# EAGLE design atcpcb (EAGLE 7.6.0)
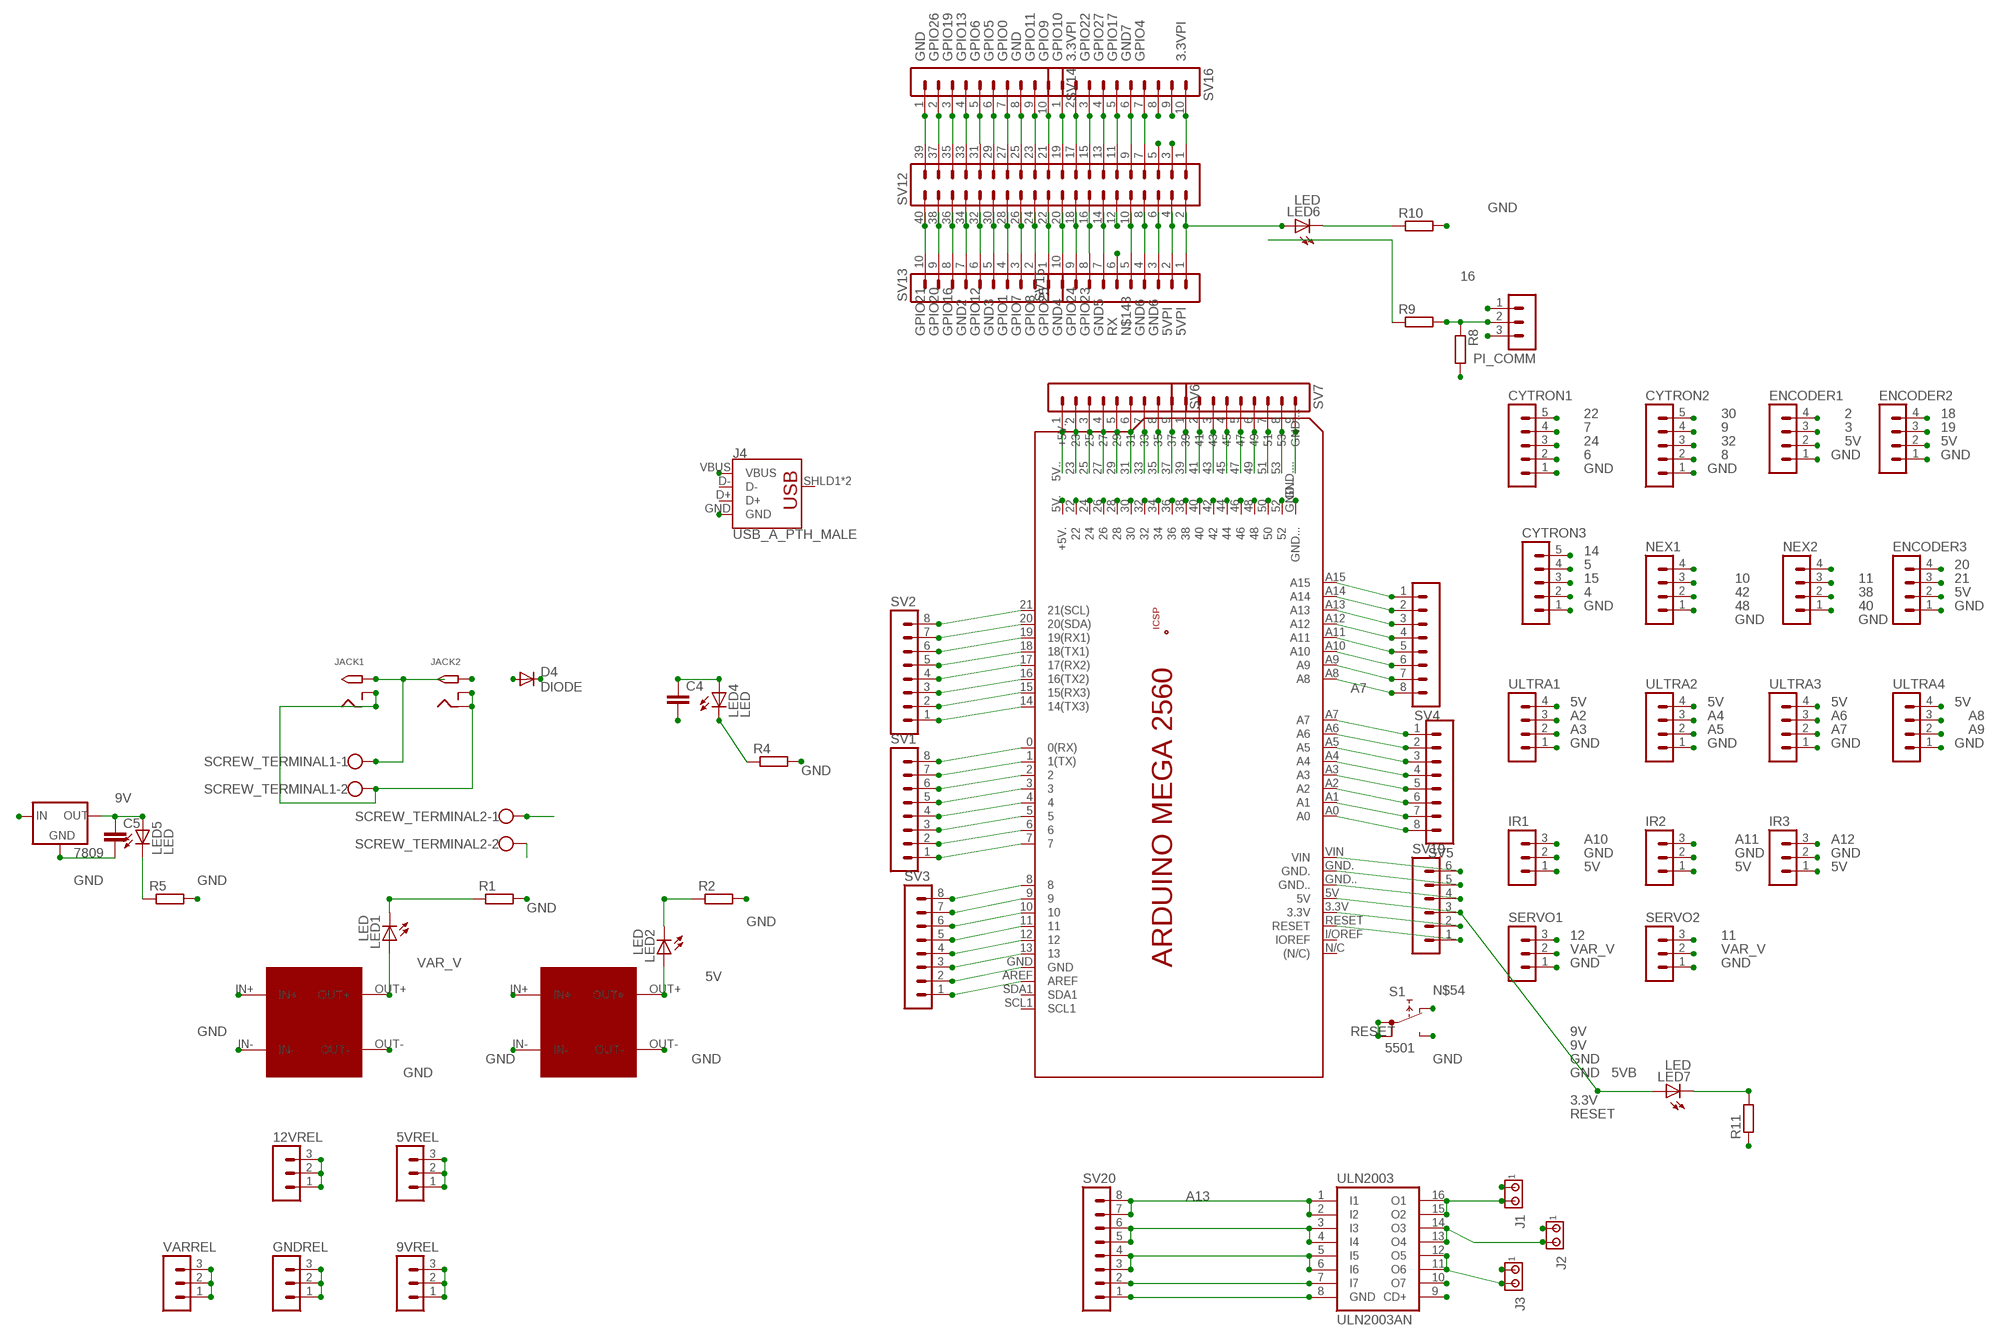
[diagram p0: schematic, sheet 1]

## Parts
5VREL  RELIMATE_03-1  [MA03-1]
9VREL  RELIMATE_03-1  [MA03-1]
12VREL  RELIMATE_03-1  [MA03-1]
7809  VOLTAGE_REGULATOR_78XXS  [78XXS]
C4  CAPACITOR075-063X106  [C075-063X106]
C5  CAPACITOR075-063X106  [C075-063X106]
CYTRON1  RELIMATE_05-1  [MA05-1]
CYTRON2  RELIMATE_05-1  [MA05-1]
CYTRON3  RELIMATE_05-1  [MA05-1]
D4  DIODE  [DIODE]
ENCODER1  RELIMATE_04-1  [MA04-1]
ENCODER2  RELIMATE_04-1  [MA04-1]
ENCODER3  RELIMATE_04-1  [MA04-1]
GNDREL  RELIMATE_03-1  [MA03-1]
IR1  RELIMATE_03-1  [MA03-1]
IR2  RELIMATE_03-1  [MA03-1]
IR3  RELIMATE_03-1  [MA03-1]
J1  MTA02-100  [10X02MTA]
J2  MTA02-100  [10X02MTA]
J3  MTA02-100  [10X02MTA]
J4  USB_A_PTH_MALE  [USB-A-H]
JACK1  2.1MM_POWER_JACKTHM  [POWER_JACK]
JACK2  2.1MM_POWER_JACKTHM  [POWER_JACK]
LED1  LED  [LED3MM]
LED2  LED  [LED3MM]
LED4  LED  [LED3MM]
LED5  LED  [LED3MM]
LED6  LED  [LED3MM]
LED7  LED  [LED3MM]
NEX1  RELIMATE_04-1  [MA04-1]
NEX2  RELIMATE_04-1  [MA04-1]
PCB1  ARDUINO_MEGA2560  [ARDUINO_MEGA2560]
PI_COMM  RELIMATE_03-1  [MA03-1]
R1  RESISTANCE0207/10  [0207/10]
R2  RESISTANCE0207/10  [0207/10]
R4  RESISTANCE0207/10  [0207/10]
R5  RESISTANCE0207/10  [0207/10]
R8  RESISTANCE0207/10  [0207/10]
R9  RESISTANCE0207/10  [0207/10]
R10  RESISTANCE0207/10  [0207/10]
R11  RESISTANCE0207/10  [0207/10]
S1  5501  [5501]
SCREW_TERMINAL1  SCREW_TERMINAL_POWER  [POWER_CONNECTOR]
SCREW_TERMINAL2  SCREW_TERMINAL_POWER  [POWER_CONNECTOR]
SERVO1  RELIMATE_03-1  [MA03-1]
SERVO2  RELIMATE_03-1  [MA03-1]
SV1  RELIMATE_08-1  [MA08-1]
SV2  RELIMATE_08-1  [MA08-1]
SV3  RELIMATE_08-1  [MA08-1]
SV4  RELIMATE_08-1  [MA08-1]
SV5  RELIMATE_08-1  [MA08-1]
SV6  RELIMATE_09-1  [MA09-1]
SV7  RELIMATE_09-1  [MA09-1]
SV12  RELIMATE_20-2  [MA20-2]
SV13  RELIMATE_10-1  [MA10-1]
SV14  RELIMATE_10-1  [MA10-1]
SV15  RELIMATE_10-1  [MA10-1]
SV16  RELIMATE_10-1  [MA10-1]
SV19  RELIMATE_06-1  [MA06-1]
SV20  RELIMATE_08-1  [MA08-1]
U$1  BUCK_CONVERTER  [BUCK_CONVERTER]
U$2  BUCK_CONVERTER  [BUCK_CONVERTER]
ULN2003  ULN2003AN  [DIL16]
ULTRA1  RELIMATE_04-1  [MA04-1]
ULTRA2  RELIMATE_04-1  [MA04-1]
ULTRA3  RELIMATE_04-1  [MA04-1]
ULTRA4  RELIMATE_04-1  [MA04-1]
VARREL  RELIMATE_03-1  [MA03-1]

## Nets
0: PCB1.0(0(RX)) SV1.8
1: PCB1.1(1(TX)) SV1.7
2: ENCODER1.4 PCB1.2 SV1.6
3: ENCODER1.3 PCB1.3 SV1.5
3.3V: PCB1.3.3V SV19.2
3.3VPI: SV12.1 SV12.17 SV16.2 SV16.10
4: CYTRON3.2 PCB1.4 SV1.4
5: CYTRON3.4 PCB1.5 SV1.3
5V: 5VREL.1 5VREL.2 5VREL.3 ENCODER1.2 ENCODER2.2 ENCODER3.2 IR1.1 IR2.1 IR3.1 J4.VBUS LED2.A U$2.OUT+ ULTRA1.4 ULTRA2.4 ULTRA3.4 ULTRA4.4
5VB: LED7.A PCB1.5V SV19.3
5VC: PCB1.5V.(+5V.) PCB1.5V..(+5V..) SV6.1
5VPI: LED6.A SV12.2 SV12.4 SV15.1 SV15.2
6: CYTRON1.2 PCB1.6 SV1.2
7: CYTRON1.4 PCB1.7 SV1.1
8: CYTRON2.2 PCB1.8 SV3.8
9: CYTRON2.4 PCB1.9 SV3.7
9V: 9VREL.1 9VREL.2 9VREL.3 7809.OUT C5.1 LED5.A PCB1.VIN SV19.6
10: NEX1.4 PCB1.10 SV3.6
11: NEX2.4 PCB1.11 SERVO2.3 SV3.5
12: PCB1.12 SERVO1.3 SV3.4
12V: 12VREL.1 12VREL.2 12VREL.3 7809.IN C4.1 D4.C J1.1 J2.1 J3.1 LED4.A U$1.IN+ U$2.IN+ ULN2003.9(CD+)
13: PCB1.13 SV3.3
14: CYTRON3.5 PCB1.14(14(TX3)) SV2.1
15: CYTRON3.3 PCB1.15(15(RX3)) SV2.2
16: PCB1.16(16(TX2)) PI_COMM.1 SV2.3
17: PCB1.17(17(RX2)) PI_COMM.2 R8.1 R9.2 SV2.4
18: ENCODER2.4 PCB1.18(18(TX1)) SV2.5
19: ENCODER2.3 PCB1.19(19(RX1)) SV2.6
20: ENCODER3.4 PCB1.20(20(SDA)) SV2.7
21: ENCODER3.3 PCB1.21(21(SCL)) SV2.8
22: CYTRON1.5 PCB1.22
23: PCB1.23 SV6.2
24: CYTRON1.3 PCB1.24
25: PCB1.25 SV6.3
26: PCB1.26
27: PCB1.27 SV6.4
28: PCB1.28
29: PCB1.29 SV6.5
30: CYTRON2.5 PCB1.30
31: PCB1.31 SV6.6
32: CYTRON2.3 PCB1.32
33: PCB1.33 SV6.7
34: PCB1.34
35: PCB1.35 SV6.8
36: PCB1.36
37: PCB1.37 SV6.9
38: NEX2.3 PCB1.38
39: PCB1.39 SV7.1
40: NEX2.2 PCB1.40
41: PCB1.41 SV7.2
42: NEX1.3 PCB1.42
43: PCB1.43 SV7.3
44: PCB1.44
45: PCB1.45 SV7.4
46: PCB1.46
47: PCB1.47 SV7.5
48: NEX1.2 PCB1.48
49: PCB1.49 SV7.6
50: PCB1.50
51: PCB1.51 SV7.7
52: PCB1.52
53: PCB1.53 SV7.8
A0: PCB1.A0 SV5.8
A1: PCB1.A1 SV5.7
A2: PCB1.A2 SV5.6 ULTRA1.3
A3: PCB1.A3 SV5.5 ULTRA1.2
A4: PCB1.A4 SV5.4 ULTRA2.3
A5: PCB1.A5 SV5.3 ULTRA2.2
A6: PCB1.A6 SV5.2 ULTRA3.3
A7: PCB1.A7 SV5.1 ULTRA3.2
A8: PCB1.A8 SV4.8 ULTRA4.3
A9: PCB1.A9 SV4.7 ULTRA4.2
A10: IR1.3 PCB1.A10 SV4.6
A11: IR2.3 PCB1.A11 SV4.5
A12: IR3.3 PCB1.A12 SV4.4
A13: PCB1.A13 SV4.3 SV20.7 SV20.8 ULN2003.1(I1) ULN2003.2(I2)
A14: PCB1.A14 SV4.2 SV20.5 SV20.6 ULN2003.3(I3) ULN2003.4(I4)
A15: PCB1.A15 SV4.1 SV20.3 SV20.4 ULN2003.5(I5) ULN2003.6(I6)
AREF: PCB1.AREF SV3.1
GND: 7809.GND C4.2 C5.2 CYTRON1.1 CYTRON2.1 CYTRON3.1 ENCODER1.1 ENCODER2.1 ENCODER3.1 GNDREL.1 GNDREL.2 GNDREL.3 IR1.2 IR2.2 IR3.2 J4.GND JACK1.RING JACK1.RING_SW JACK2.RING JACK2.RING_SW NEX1.1 NEX2.1 PCB1.GND PCB1.GND. PCB1.GND.. PCB1.GND... PCB1.GND.... PI_COMM.3 R1.2 R2.2 R4.2 R5.2 R8.2 R10.2 R11.1 S1.NO SCREW_TERMINAL1.2 SCREW_TERMINAL2.2 SERVO1.1 SERVO2.1 SV3.2 SV7.9 SV12.25 SV12.39 SV14.1 SV14.8 SV19.4 SV19.5 SV20.1 U$1.IN- U$1.OUT- U$2.IN- U$2.OUT- ULN2003.8(GND) ULTRA1.1 ULTRA2.1 ULTRA3.1 ULTRA4.1
GND2: SV12.34 SV13.7
GND3: SV12.30 SV13.5
GND4: SV12.20 SV15.10
GND5: SV12.14 SV15.7
GND6: SV12.6 SV12.8 SV15.3 SV15.4
GND7: SV12.9 SV16.6
GPIO0: SV12.27 SV14.7
GPIO1: SV12.28 SV13.4
GPIO4: SV12.7 SV16.7
GPIO5: SV12.29 SV14.6
GPIO6: SV12.31 SV14.5
GPIO7: SV12.26 SV13.3
GPIO8: SV12.24 SV13.2
GPIO9: SV12.21 SV14.10
GPIO10: SV12.19 SV16.1
GPIO11: SV12.23 SV14.9
GPIO12: SV12.32 SV13.6
GPIO13: SV12.33 SV14.4
GPIO16: SV12.36 SV13.8
GPIO17: SV12.11 SV16.5
GPIO19: SV12.35 SV14.3
GPIO20: SV12.38 SV13.9
GPIO21: SV12.40 SV13.10
GPIO22: SV12.15 SV16.3
GPIO23: SV12.16 SV15.8
GPIO24: SV12.18 SV15.9
GPIO25: SV12.22 SV13.1
GPIO26: SV12.37 SV14.2
GPIO27: SV12.13 SV16.4
N$17: LED1.K(C) R1.1
N$21: LED2.K(C) R2.1
N$33: LED6.K(C) R10.1
N$49: LED7.K(C) R11.2
N$52: SV20.2 ULN2003.7(I7)
N$54: S1.NC
N$65: J1.2 ULN2003.15(O2) ULN2003.16(O1)
N$67: J2.2 ULN2003.13(O4) ULN2003.14(O3)
N$69: J3.2 ULN2003.11(O6) ULN2003.12(O5)
N$71: ULN2003.10(O7)
N$77: LED4.K(C) R4.1
N$85: LED5.K(C) R5.1
N$143: SV12.10 SV15.5
RESET: PCB1.RESET S1.1A S1.1B SV19.1
RX: R9.1 SV12.12 SV15.6
SCL: SV12.5 SV16.8
SDA: SV12.3 SV16.9
VAR_V: LED1.A SERVO1.2 SERVO2.2 U$1.OUT+ VARREL.1 VARREL.2 VARREL.3
VIN: D4.A JACK1.TIP JACK2.TIP SCREW_TERMINAL1.1 SCREW_TERMINAL2.1
Unconnected: J4.D+ J4.D- J4.SHLD1(SHIELD) J4.SHLD2(SHIELD) PCB1.+5V_ PCB1.GND__ PCB1.I/OREF(IOREF) PCB1.MISO PCB1.MOSI PCB1.N/C((N/C)) PCB1.RESET. PCB1.SCK PCB1.SCL1 PCB1.SDA1

## Library data of the parts
5VREL 9VREL 12VREL GNDREL IR1-IR3 PI_COMM SERVO1 SERVO2 VARREL = robocon:RELIMATE_03-1: PIN HEADER; OC_FARNELL: unknown; OC_NEWARK: unknown
7809 = robocon:VOLTAGE_REGULATOR_78XXS: VOLTAGE REGULATOR
C4 C5 = robocon:CAPACITOR: CAPACITOR, European symbol
CYTRON1-CYTRON3 = robocon:RELIMATE_05-1: PIN HEADER; OC_FARNELL: unknown; OC_NEWARK: unknown
D4 = robocon:DIODE: DIODE fast recovery diode, 5 A, 800 V
ENCODER1-ENCODER3 NEX1 NEX2 ULTRA1-ULTRA4 = robocon:RELIMATE_04-1: PIN HEADER; OC_FARNELL: unknown; OC_NEWARK: unknown
J1-J3 = con-amp:MTA02-100: AMP connector
J4 = SparkFun-Connectors:USB_A: USB-A Connector Male and female variants, as well as PTH and SMT variants SparkFun Products: SparkFun XBee Explorer Dongle <https://www.sparkfun.com/products/11697> PTH Male SparkFun MicroView-USB Programmer <https://www.sparkfun.com/products/12924> SMT Male SparkFun USB Type A Female Breakout <https://www.sparkfun.com/products/12700> SMT Female; PROD_ID: CONN-08367; SF_ID: PRT-00437
JACK1 JACK2 = robocon:2.1MM_POWER_JACK: 2.1mm x 5.5mm THM DC jack with internal switch. Digikey part #PJ-102A, 4UCON part #05537 2.1mm x 5.5mm SMT DC jack with internal switch. Digikey part #PJ-002A-SMT, 4UCON part #03267 By microbuilder.eu & adafruit.com
LED1 LED2 LED4-LED7 = robocon:LED: Low Current (2mA) LED 3 mm Tinted Diffused Package color RED Source: Data sheet <http://www.farnell.com/datasheets/391100.pdf>; MF: VISHAY SEMICONDUCTOR; OC_FARNELL: 1612437
PCB1 = robocon:ARDUINO_MEGA2560: Device for representing an Arduino Mega 2560 board with a footprint in an EAGLE design. Created by Dave Young for Element14. More EAGLE documentation at: http://www.element14.com/community/community/knode/cadsoft_eagle
R1 R2 R4 R5 R8-R11 = robocon:RESISTANCE: RESISTOR, European symbol
S1 = switch:55?: PUSHBUTTON SERIES 5500 SWITCHES Source: www.e-switch.com .. 5500.pdf
SCREW_TERMINAL1 SCREW_TERMINAL2 = robocon:SCREW_TERMINAL_POWER: WAGO SCREW CLAMP; MPN: 237-102; OC_FARNELL: unknown; OC_NEWARK: 70K9898
SV1-SV5 SV20 = robocon:RELIMATE_08-1: PIN HEADER; OC_FARNELL: unknown; OC_NEWARK: unknown
SV6 SV7 = robocon:RELIMATE_09-1: PIN HEADER; OC_FARNELL: unknown; OC_NEWARK: unknown
SV12 = robocon:RELIMATE_20-2: PIN HEADER; OC_FARNELL: unknown; OC_NEWARK: unknown
SV13-SV16 = robocon:RELIMATE_10-1: PIN HEADER; OC_FARNELL: unknown; OC_NEWARK: unknown
SV19 = robocon:RELIMATE_06-1: PIN HEADER; OC_FARNELL: unknown; OC_NEWARK: unknown
U$1 U$2 = robocon:BUCK_CONVERTER: LM2596-DC-DC-buck-converter-adjustable-3V-40V-step-down-module-power-supply LM; MF: POWER INTEGRATIONS; MPN: LNK304DN; OC_FARNELL: 1448222
ULN2003 = uln-udn:ULN2003A: DRIVER ARRAY

## Net classes
0 default: width 0.381 mm, drill 0.381 mm, clearance 0.254 mm

## Board
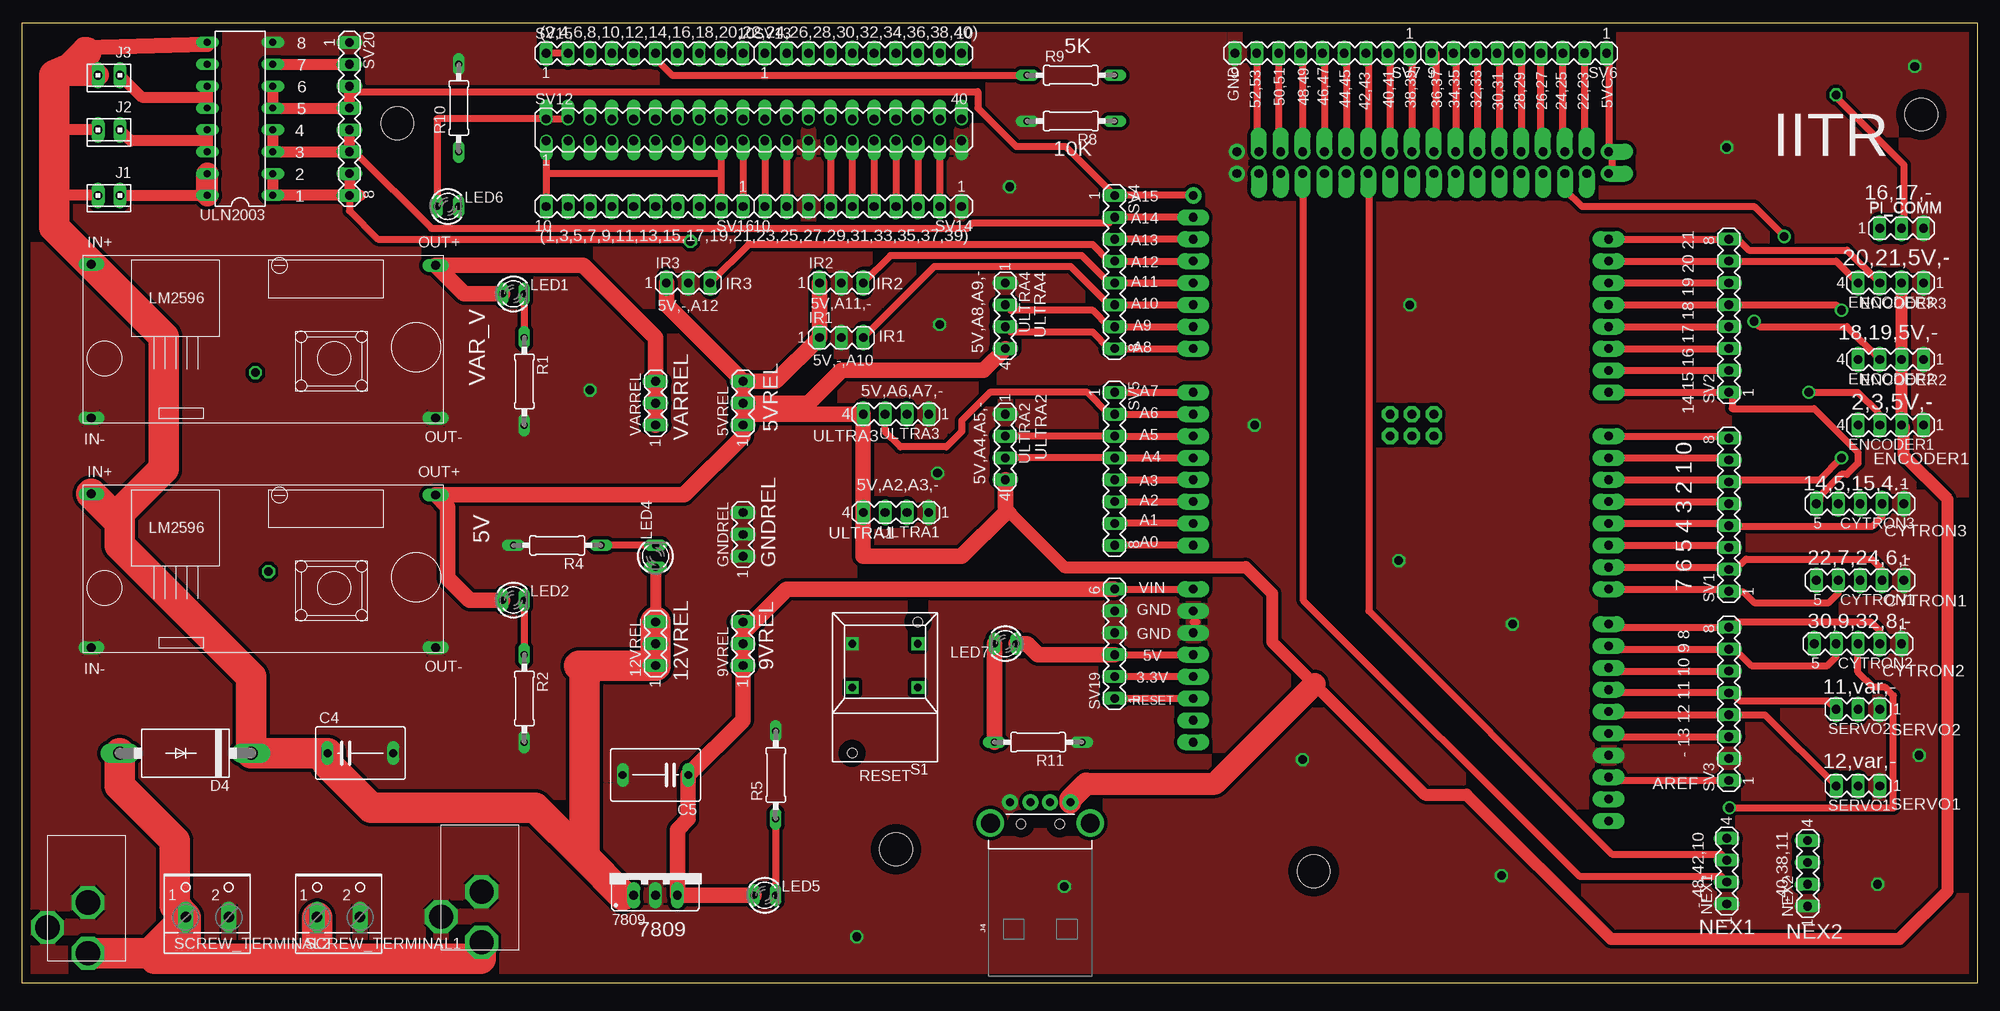
[diagram p1: board, top side]
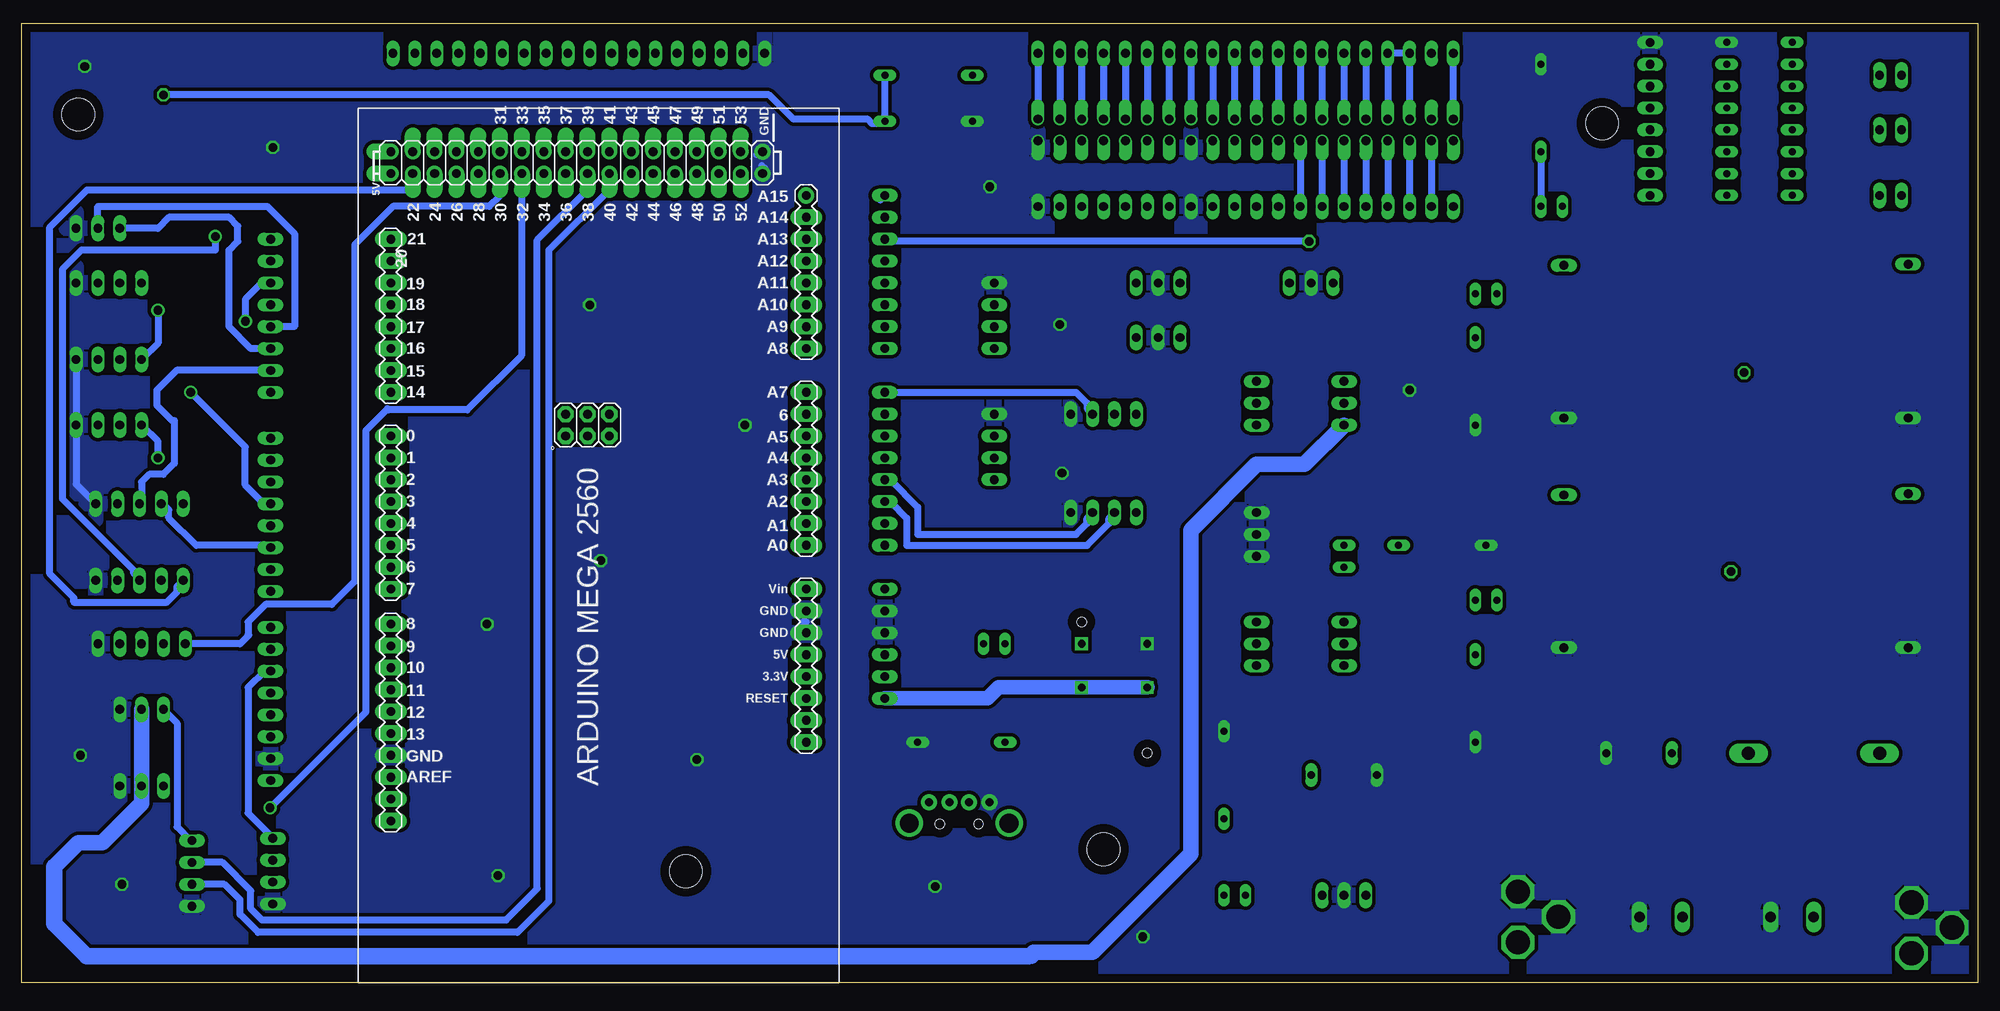
[diagram p2: board, bottom side, seen from below]

Size 227.31 x 111.43 mm. Coordinates in mm from the lower left corner, seen from the top.
Outline: 0,0 227.31,0 227.31,111.43 0,111.43 0,0
Copper layers (1*16): Top 0.035mm / dielectric 1.5mm / Bottom 0.035mm
Design rules "default *": minimum track width 32mil, minimum drill 40mil, track to track 16mil, track to pad 16mil, pad to pad 16mil, via to via 16mil, smd to smd 6mil, copper to edge 40mil, drill to drill 16mil, minimum pad ring 10mil, minimum via ring 8mil, stop-mask expansion 4mil, vias tented up to drill 0mil, thermal gap 10mil
Holes 3.81 mm at 101.6,15.49 150.11,12.95 220.73,100.84 43.69,99.82

### Footprints (pad centres in the part's own frame; a part is rotated, then mirrored left to right if it is on the bottom)
MA03-1 = drill 1.016 long: 1 -2.54,0; 2 0,0; 3 2.54,0
78XXS = drill 1.016 long: GND 0,-2.54; IN -2.54,-2.54; OUT 2.54,-2.54
C075-063X106 = drill 0.914 long: 1 -3.81,0; 2 3.81,0
MA05-1 = drill 1.016 long: 1 -5.08,0; 2 -2.54,0; 3 0,0; 4 2.54,0; 5 5.08,0
DIODE = drill 1.499 long: A 7.62,0; C -7.62,0
MA04-1 = drill 1.016 long: 1 -3.81,0; 2 -1.27,0; 3 1.27,0; 4 3.81,0
10X02MTA = drill 1.016 long: 1 1.27,0; 2 -1.27,0
USB-A-H = drill 0.914 pad 1.88: D+ 2.4,1.127; D- 2.4,-1.127; GND 2.4,3.5; VBUS 2.4,-3.5 | drill 2.2: SHLD1 0,-5.8; SHLD2 0,5.8 | hole 1.1: -0.1,2.25; -0.1,-2.25
POWER_JACK = drill 2.8 pad 3.81 octagon: RING 0.1,-3.39; RING_SW -4.6,-6.29; TIP 0.1,-9.29
LED3MM = drill 0.813 long: A -1.27,0; K 1.27,0
ARDUINO_MEGA2560 = drill 1.016 pad 1.88 long: 0 63.5,50.8; 1 60.96,50.8; 2 58.42,50.8; 3 55.88,50.8; 3.3V 35.56,2.54; 4 53.34,50.8; 5 50.8,50.8; 5V 38.1,2.54; 6 48.26,50.8; 7 45.72,50.8; 8 41.656,50.8; 9 39.116,50.8; 10 36.576,50.8; 11 34.036,50.8; 12 31.496,50.8; 13 28.956,50.8; 14 68.58,50.8; 15 71.12,50.8; 16 73.66,50.8; 17 76.2,50.8; 18 78.74,50.8; 19 81.28,50.8; 20 83.82,50.8; 21 86.36,50.8; A0 50.8,2.54; A1 53.34,2.54; A2 55.88,2.54; A3 58.42,2.54; A4 60.96,2.54; A5 63.5,2.54; A6 66.04,2.54; A7 68.58,2.54; A8 73.66,2.54; A9 76.2,2.54; A10 78.74,2.54; A11 81.28,2.54; A12 83.82,2.54; A13 86.36,2.54; A14 88.9,2.54; AREF 23.876,50.8; GND 26.416,50.8; GND. 43.18,2.54; GND.. 40.64,2.54; I/OREF 30.48,2.54; N/C 27.94,2.54; RESET 33.02,2.54; SCL1 18.796,50.8; SDA1 21.336,50.8; VIN 45.72,2.54 | drill 1.016 pad 1.88 offset: 5V. 93.98,50.8; 5V.. 96.52,50.8; 22 93.98,48.26; 23 96.52,48.26; 24 93.98,45.72; 25 96.52,45.72; 26 93.98,43.18; 27 96.52,43.18; 28 93.98,40.64; 29 96.52,40.64; 30 93.98,38.1; 31 96.52,38.1; 32 93.98,35.56; 33 96.52,35.56; 34 93.98,33.02; 35 96.52,33.02; 36 93.98,30.48; 37 96.52,30.48; 38 93.98,27.94; 39 96.52,27.94; 40 93.98,25.4; 41 96.52,25.4; 42 93.98,22.86; 43 96.52,22.86; 44 93.98,20.32; 45 96.52,20.32; 46 93.98,17.78; 47 96.52,17.78; 48 93.98,15.24; 49 96.52,15.24; 50 93.98,12.7; 51 96.52,12.7; 52 93.98,10.16; 53 96.52,10.16 | drill 1.016 pad 1.88 octagon: +5V_ 66.04,30.48; GND__ 66.04,25.4; MISO 63.5,30.48; MOSI 66.04,27.94; RESET. 63.5,25.4; SCK 63.5,27.94 | drill 1.016 pad 1.88: A15 91.44,2.54; GND... 93.98,7.62; GND.... 96.52,7.62
0207/10 = drill 0.813 long: 1 -5.08,0; 2 5.08,0
5501 = drill 0.9 pad 1.5 square: 1A 0,3.81; 1B 0,-3.81; NC 5.08,-3.81; NO 5.08,3.81 | hole 1.1: -7.62,3.81; 7.62,-3.81
POWER_CONNECTOR = drill 1.194 long: 1 -2.5,-1.27; 2 2.5,-1.27
MA08-1 = drill 1.016 long: 1 -8.89,0; 2 -6.35,0; 3 -3.81,0; 4 -1.27,0; 5 1.27,0; 6 3.81,0; 7 6.35,0; 8 8.89,0
MA09-1 = drill 1.016 long: 1 -10.16,0; 2 -7.62,0; 3 -5.08,0; 4 -2.54,0; 5 0,0; 6 2.54,0; 7 5.08,0; 8 7.62,0; 9 10.16,0
MA20-2 = drill 1.016 offset: 1 -24.13,-1.27; 2 -24.13,1.27; 3 -21.59,-1.27; 4 -21.59,1.27; 5 -19.05,-1.27; 6 -19.05,1.27; 7 -16.51,-1.27; 8 -16.51,1.27; 9 -13.97,-1.27; 10 -13.97,1.27; 11 -11.43,-1.27; 12 -11.43,1.27; 13 -8.89,-1.27; 14 -8.89,1.27; 15 -6.35,-1.27; 16 -6.35,1.27; 17 -3.81,-1.27; 18 -3.81,1.27; 19 -1.27,-1.27; 20 -1.27,1.27; 21 1.27,-1.27; 22 1.27,1.27; 23 3.81,-1.27; 24 3.81,1.27; 25 6.35,-1.27; 26 6.35,1.27; 27 8.89,-1.27; 28 8.89,1.27; 29 11.43,-1.27; 30 11.43,1.27; 31 13.97,-1.27; 32 13.97,1.27; 33 16.51,-1.27; 34 16.51,1.27; 35 19.05,-1.27; 36 19.05,1.27; 37 21.59,-1.27; 38 21.59,1.27; 39 24.13,-1.27; 40 24.13,1.27
MA10-1 = drill 1.016 long: 1 -11.43,0; 2 -8.89,0; 3 -6.35,0; 4 -3.81,0; 5 -1.27,0; 6 1.27,0; 7 3.81,0; 8 6.35,0; 9 8.89,0; 10 11.43,0
MA06-1 = drill 1.016 long: 1 -6.35,0; 2 -3.81,0; 3 -1.27,0; 4 1.27,0; 5 3.81,0; 6 6.35,0
BUCK_CONVERTER = drill 1.016 long: IN+ -18.558,7.255; IN- -18.558,-10.618; OUT+ 21.442,7.128; OUT- 21.442,-10.618
DIL16 = drill 0.813 long: 1 -8.89,-3.81; 2 -6.35,-3.81; 3 -3.81,-3.81; 4 -1.27,-3.81; 5 1.27,-3.81; 6 3.81,-3.81; 7 6.35,-3.81; 8 8.89,-3.81; 9 8.89,3.81; 10 6.35,3.81; 11 3.81,3.81; 12 1.27,3.81; 13 -1.27,3.81; 14 -3.81,3.81; 15 -6.35,3.81; 16 -8.89,3.81

### Placement (x,y rotation side)
5VREL  83.82,67.31 90 top
9VREL  83.82,39.37 90 top
12VREL  73.66,39.37 90 top
7809  73.66,12.7 0 top
C4  39.37,26.67 0 top
C5  73.66,24.13 180 top
CYTRON1  213.61,46.74 180 top
CYTRON2  213.36,39.37 180 top
CYTRON3  213.61,55.63 180 top
D4  19.05,26.67 180 top
ENCODER1  217.17,64.77 180 top
ENCODER2  217.17,72.39 180 top
ENCODER3  217.17,81.28 180 top
GNDREL  83.82,52.07 90 top
IR1  95.25,74.93 0 top
IR2  95.25,81.28 0 top
IR3  77.47,81.28 0 top
J1  10.16,91.44 180 top
J2  10.16,99.06 180 top
J3  10.16,105.41 180 top
J4  118.36,18.54 90 top
JACK1  7.62,12.7 0 top
JACK2  53.34,13.97 0 top
LED1  57.15,80.01 0 top
LED2  57.15,44.45 0 top
LED4  73.66,49.53 90 top
LED5  86.36,10.16 0 top
LED6  49.53,90.17 0 top
LED7  114.3,39.37 180 top
NEX1  198.12,12.95 90 top
NEX2  207.52,12.7 90 top
PCB1  133.6,0 90 bottom
PI_COMM  218.44,87.63 0 top
R1  58.42,69.85 270 top
R2  58.42,33.02 270 top
R4  62.23,50.8 180 top
R5  87.63,24.13 90 top
R8  121.92,100.08 180 top
R9  121.92,105.41 0 top
R10  50.8,101.6 90 top
R11  118.11,27.94 180 top
S1  100.33,34.29 90 top
SCREW_TERMINAL1  36.83,8.89 0 top
SCREW_TERMINAL2  21.59,8.89 0 top
SERVO1  213.36,22.86 180 top
SERVO2  213.36,31.75 180 top
SV1  198.37,54.36 90 top
SV2  198.37,77.47 90 top
SV3  198.37,32.38 90 top
SV4  127,82.55 270 top
SV5  127,59.69 270 top
SV6  173.99,107.95 180 top
SV7  151.13,107.95 180 top
SV12  85.09,99.06 0 top
SV13  97.79,107.95 0 top
SV14  97.79,90.17 180 top
SV15  72.39,107.95 0 top
SV16  72.39,90.17 180 top
SV19  127,39.37 90 top
SV20  38.1,100.33 270 top
U$1  26.67,76.2 0 top
U$2  26.67,49.53 0 top
ULN2003  25.4,100.33 90 top
ULTRA1  101.6,54.61 180 top
ULTRA2  114.3,62.23 270 top
ULTRA3  101.6,66.04 180 top
ULTRA4  114.3,77.47 270 top
VARREL  73.66,67.31 90 top

### Tracks (layer width: path | path; a pad name or v marks a point on that pad's centre or on a via)
0
  Top 0.813: PCB1.0 198.12,63.5 SV1.8
1
  Top 0.813: PCB1.1 198.12,60.96 SV1.7
2  (via drill 1.02)
  Top 0.813: PCB1.2 198.12,58.42 SV1.6 198.75,58.42 208.92,58.42 v211.46,60.96
  Bottom 0.813: ENCODER1.4 211.46,62.87 v211.46,60.96
3  (via drill 1.02)
  Top 0.813: PCB1.3 198.12,55.88 SV1.5 | v207.65,68.58 213.36,68.58 215.65,66.29 215.65,65.02 ENCODER1.3
  Bottom 0.813: v207.65,68.58 201.3,62.23 201.3,57.79 198.75,55.25 SV1.5
3.3V
  Top 0.813: PCB1.3.3V SV19.2
3.3VPI
  Top 0.813: SV12.1 60.96,93.98 | 60.96,93.98 SV16.10 | SV12.17 81.28,93.98 | 81.28,93.98 SV16.2 | 81.28,93.98 60.96,93.98
4
  Top 0.813: PCB1.4 198.12,53.34 SV1.4 198.75,53.02 215.08,53.02 216.15,54.1 CYTRON3.2 215.9,55.56
5
  Top 0.813: PCB1.5 198.12,50.8 SV1.3
  Bottom 0.813: CYTRON3.4 210.82,55.56 210.19,54.93 210.19,53.98 207.01,50.8 198.44,50.8 SV1.3
5V
  Top 0.813: 90.81,66.04 90.81,67.31 | 114.94,54.61 114.3,54.61
  Top 1.422: 114.94,54.61 114.94,54.48 121.16,48.26 142.24,48.26 145.29,45.21 145.29,39.62 150.24,34.67 163.07,21.84 167.89,21.84 184.66,5.08 218.19,5.08 223.77,10.67 223.77,56.13 218.69,61.21 218.69,64.52 ENCODER1.2 ENCODER2.2 ENCODER3.2
  Top 1.778: LED2.A 52.07,44.45 49.53,46.99 49.53,55.24 U$2.OUT+ 76.98,56.66 83.82,63.5 5VREL.1 83.82,66.04 | 5VREL.3 83.82,66.04 | IR3.1 74.93,78.74 5VREL.3 | IR2.1 IR1.1 87.63,69.85 5VREL.3 | 83.82,66.04 90.81,66.04 ULTRA3.4 ULTRA1.4 97.79,49.53 109.22,49.53 114.3,54.61 ULTRA2.4 | 5VREL.2 90.81,67.31 91.44,67.31 95.25,71.12 111.76,71.12 ULTRA4.4
  Top 2.54: J4.VBUS 121.86,21.28 123.7,23.11 138.68,23.11 150.24,34.67
5VB
  Top 0.813: SV19.3 PCB1.5V
  Top 1.778: SV19.3 118.11,38.1 116.84,39.37 LED7.A
5VC
  Top 0.813: PCB1.5V. 184.79,93.98 184.79,96.52 PCB1.5V.. 184.4,107.95 SV6.1
  Bottom 0.813: 184.15,96.52 PCB1.5V..
5VPI
  Top 0.813: SV15.2 SV15.1 | LED6.A 48.26,100.33 SV12.2 SV12.4
  Bottom 0.813: SV12.2 SV15.1
6
  Top 0.813: PCB1.6 198.12,48.26 SV1.2 198.75,47.94 199.07,47.94 200.34,49.21 214.95,49.21 216.15,48.01 CYTRON1.2 215.9,46.99
7
  Top 0.813: PCB1.7 198.12,45.72 SV1.1 198.75,45.4 200.03,45.4 201.3,44.13 209.99,44.13 211.07,45.21 CYTRON1.4 210.82,46.67
8
  Top 0.813: PCB1.8 184.79,41.28 SV3.8 198.75,41.28 199.39,41.91 214.88,41.91 215.9,40.89 CYTRON2.2
9
  Top 0.813: PCB1.9 184.79,38.74 SV3.7 199.07,38.74 200.98,36.83 209.8,36.83 210.82,37.85 CYTRON2.4
9V
  Top 0.813: SV19.6 PCB1.VIN
  Top 1.778: LED5.A 7809.OUT 76.2,17.78 77.47,19.05 C5.1 83.82,30.48 9VREL.1 9VREL.2 83.82,40.64 | 83.82,40.64 9VREL.3 | SV19.6 88.9,45.72 83.82,40.64
10
  Top 0.813: SV3.6 184.79,36.2 PCB1.10
  Bottom 0.813: SV3.6 199.07,36.2 200.98,34.29 200.98,19.68 198.12,16.83 NEX1.4
11
  Top 0.813: PCB1.11 184.79,33.66 SV3.5 198.75,33.66 199.71,32.7 209.87,32.7 SERVO2.3
  Bottom 0.813: SERVO2.3 209.23,30.16 209.23,18.1 207.65,16.51 NEX2.4
12
  Top 0.813: PCB1.12 184.79,31.11 SV3.4 202.56,31.11 SERVO1.3
12V
  Top 0.813: ULN2003.9 21.59,109.02 | 7809.IN 69.85,10.16
  Top 1.27: LED4.A 73.66,40.64 | J2.1 5.08,99.06 3.81,97.79 | J1.1 3.81,91.44
  Top 1.778: 7.25,108.59 21.59,109.02
  Top 2.54: 7.51,108.09 7.25,108.59 | J3.1 5.08,105.41 5.59,106.17
  Top 3.556: 65.41,14.61 59.69,20.32 40.64,20.32 35.56,25.4 C4.1 D4.C 26.67,35.56 11.43,50.8 11.43,53.47 | 65.41,14.61 69.85,10.16 | 65.41,14.61 65.41,36.2 64.77,36.83 12VREL.1 12VREL.2 73.66,40.64 12VREL.3 | 11.43,53.47 U$2.IN+ | 11.43,53.47 11.43,54.61 16.51,59.69 16.51,75.06 U$1.IN+ 3.81,87.76 3.81,91.44 3.81,97.79 3.81,105.41 5.59,106.17 7.51,108.09
13
  Top 0.813: SV3.3 184.79,28.57 PCB1.13
14
  Top 0.813: PCB1.14 SV2.1 198.75,68.58 198.75,66.67 208.28,66.67 213.36,61.6 213.36,60.33 212.09,59.05 211.46,59.05 208.92,56.52 208.92,55.88 CYTRON3.5
15
  Top 0.813: PCB1.15 SV2.2
  Bottom 0.813: SV2.2 209.3,71.12 211.58,68.83 211.58,67.06 209.8,65.28 209.55,65.28 209.55,60.33 210.82,59.05 212.47,59.05 213.36,58.17 213.36,55.88 CYTRON3.3
16
  Top 0.813: PCB1.16 SV2.3
  Bottom 0.813: PI_COMM.1 211.46,87.63 210.19,88.9 203.2,88.9 202.18,87.88 202.18,86.11 203.2,85.09 203.2,76.2 200.66,73.66 SV2.3
17  (via drill 1)
  Top 0.813: PCB1.17 SV2.4 | v210.82,103.12 210.82,102.87 218.69,95 218.69,87.88 PI_COMM.2
  Bottom 0.813: SV2.4 195.58,76.2 195.58,86.99 198.75,90.17 218.44,90.17 PI_COMM.2 | v210.82,103.12 140.46,103.12 137.67,100.33 129.03,100.33 128.52,99.82 127.25,99.82 R8.1 R9.2
18  (via drill 1.02)
  Top 0.813: PCB1.18 SV2.5 210.82,78.74 v211.46,78.1
  Bottom 0.813: ENCODER2.4 211.46,74.3 v211.46,78.1
19  (via drill 1.02)
  Top 0.813: PCB1.19 SV2.6 | v201.3,76.83 201.93,76.2 212.09,76.2 ENCODER2.3
  Bottom 0.813: v201.3,76.83 201.3,79.38 199.39,81.28 SV2.6
20
  Top 0.813: PCB1.20 SV2.7 210.82,83.82 ENCODER3.4
21
  Top 0.813: PCB1.21 SV2.8 199.39,86.36 200.66,85.09 212.09,85.09 ENCODER3.3
22
  Bottom 0.813: CYTRON1.5 209.23,46.04 209.23,45.4 210.5,44.13 221.17,44.13 221.23,44.2 221.23,44.7 224.03,47.5 224.03,87.76 223.84,87.95 223.58,88.2 219.71,92.08 181.93,92.08 181.93,93.98 PCB1.22
23
  Top 0.813: PCB1.23 181.61,96.52 SV6.2
24  (via drill 1.02)
  Top 0.813: v204.79,86.68 201.3,90.17 181.29,90.17 179.39,92.08 179.39,93.98 PCB1.24
  Bottom 0.813: v204.79,86.68 204.79,85.09 220.35,85.09 222.57,82.87 222.57,56.2 214.31,47.94 214.31,47.62 213.68,46.99 CYTRON1.3
25
  Top 0.813: PCB1.25 179.07,96.52 SV6.3
27
  Top 0.813: PCB1.27 176.53,96.52 SV6.4
29
  Top 0.813: SV6.5 174.24,107.95 PCB1.29
30
  Bottom 0.813: PCB1.30 171.77,93.98 171.77,91.38 172.97,90.17 184.15,90.17 184.28,90.04 188.6,85.72 188.6,46.61 191.26,43.94 198.95,43.94 200.98,41.91 200.98,40.45 200.91,40.39 201.93,39.37 CYTRON2.5
31
  Top 0.813: SV6.6 171.7,107.95 PCB1.31
32  (via drill 1.02)
  Top 0.813: v198.44,20.32 217.49,20.32 217.49,33.34 216.54,34.29 215.14,34.29 213.36,36.07 CYTRON2.3
  Bottom 0.813: v198.44,20.32 187.33,31.43 187.33,64.14 184.79,66.67 184.66,66.55 175.51,66.55 169.23,72.83 169.23,93.98 PCB1.32
33
  Top 0.813: SV6.7 169.16,107.95 PCB1.33
35
  Top 0.813: SV6.8 166.62,107.95 PCB1.35
37
  Top 0.813: SV6.9 164.34,107.95 164.34,96.01 164.08,96.01 PCB1.37
38
  Bottom 0.813: PCB1.38 161.61,93.98 161.61,92.08 167.39,86.3 167.39,10.92 171.01,7.3 199.39,7.3 200.66,8.57 200.66,10.67 203.96,13.97 NEX2.3
39
  Top 0.813: SV7.1 161.54,107.95 PCB1.39
40
  Bottom 0.813: PCB1.40 159.07,93.98 159.07,92.08 166.05,85.09 166.05,9.46 169.67,5.84 199.84,5.84 201.93,7.94 201.93,9.65 203.71,11.43 NEX2.2
41
  Top 0.813: SV7.2 159,107.95 PCB1.41
42
  Top 0.813: NEX1.3 198.12,14.29 197.49,14.92 184.79,14.92 156.53,43.18 156.53,93.98 PCB1.42
43
  Top 0.813: SV7.3 156.46,107.95 PCB1.43
45
  Top 0.813: SV7.4 153.92,107.95 PCB1.45
47
  Top 0.813: SV7.5 151.38,107.95 PCB1.47
48
  Top 0.813: NEX1.2 198.12,11.75 197.49,12.38 180.98,12.38 148.91,44.45 148.91,93.98 PCB1.48
49
  Top 0.813: SV7.6 148.84,107.95 PCB1.49
51
  Top 0.813: SV7.7 146.05,96.77 PCB1.51
53
  Top 0.813: SV7.8 143.51,96.77 PCB1.53
A0
  Top 0.813: PCB1.A0 SV5.8
A1
  Top 0.813: PCB1.A1 SV5.7
A2
  Top 0.813: SV5.6 PCB1.A2
  Bottom 0.813: ULTRA1.3 100.97,53.98 100.97,53.34 103.51,50.8 124.46,50.8 124.46,53.98 126.37,55.88 SV5.6
A3
  Top 0.813: SV5.5 PCB1.A3
  Bottom 0.813: ULTRA1.2 103.51,53.98 103.51,53.34 104.78,52.07 123.19,52.07 123.19,55.25 126.37,58.42 SV5.5
A4
  Top 0.813: ULTRA2.3 SV5.4 PCB1.A4
A5
  Top 0.813: ULTRA2.2 SV5.3 PCB1.A5
A6
  Top 0.813: PCB1.A6 SV5.2 126.37,66.04 123.83,68.58 112.52,68.58 109.22,65.28 109.22,64.01 107.44,62.23 102.11,62.23 100.33,64.01 ULTRA3.3
A7
  Top 0.813: SV5.1 PCB1.A7
  Bottom 0.813: ULTRA3.2 103.51,66.67 103.51,67.31 104.78,68.58 SV5.1
A8
  Top 0.813: ULTRA4.3 114.94,75.56 124.46,75.56 126.37,73.66 SV4.8 PCB1.A8
A9
  Top 0.813: ULTRA4.2 114.94,78.1 124.46,78.1 126.37,76.2 SV4.7 PCB1.A9
A10
  Top 0.813: IR1.3 106.05,83.19 121.92,83.19 126.37,78.74 SV4.6 PCB1.A10
A11
  Top 0.813: IR2.3 100.97,84.45 123.19,84.45 126.37,81.28 SV4.5 PCB1.A11
  Bottom 0.813: SV4.5 127,81.03
A12
  Top 0.813: IR3.3 84.46,85.72 124.46,85.72 126.37,83.82 SV4.4 PCB1.A12
A13  (via drill 1)
  Top 0.813: PCB1.A13 SV4.3 | SV20.8 38.1,89.66 41.4,86.36 77.47,86.36 v77.72,86.11
  Top 1.27: ULN2003.2 ULN2003.1 SV20.8 | 39.37,91.44 SV20.8 | SV20.7 SV20.8
  Bottom 0.813: v77.72,86.11 126.75,86.11 SV4.3
A14
  Top 0.813: PCB1.A14 SV4.2 126.37,88.27 110.49,88.27 109.86,87.63 47.63,87.63 38.74,96.52 SV20.6
  Top 1.27: ULN2003.4 ULN2003.3 SV20.6 SV20.5
A15
  Top 0.813: PCB1.A15 SV4.1 121.29,97.16 115.57,97.16 111.13,101.6 111.13,103.5 38.1,103.5
  Top 1.27: ULN2003.6 ULN2003.5 SV20.4 38.1,103.5 SV20.3
  Bottom 0.813: 128.02,91.44 127.51,90.93 SV4.1
AREF
  Top 0.813: SV3.1 184.79,23.5 PCB1.AREF
GND  (via drill 1)
  Top 0.813: 136.53,41.91 136.14,41.91
  Bottom 0.813: PCB1.GND.... 141.92,96.2 141.22,96.2 | 141.29,94.93 141.22,94.44 140.97,94.61 PCB1.GND... 141.29,94.3 141.22,94.3 | PCB1.GND. 135.89,43.18 136.14,42.72 | 136.53,41.91 136.14,41.91 | PCB1.GND.... 141.29,96.52 PCB1.GND.... | ENCODER2.1 ENCODER1.1 220.98,57.91 CYTRON3.1 | 136.21,40.64 PCB1.GND.. 136.21,40.64
  other vias: 97.03,5.33 121.16,11.18 148.84,25.91 171.96,12.45 173.23,41.66 220.47,26.42 215.65,11.43 143.26,64.77 160.02,49.02 161.29,78.74 198.12,97.03 219.96,106.43 66.04,68.83 114.81,92.46 106.68,76.45 106.43,59.18
  pour Top: 0,111.76 0,-1.27 1.27,-2.54 226.06,-2.54 229.87,1.27 229.87,110.49 226.06,114.3 223.52,114.3 2.54,114.3
  pour Bottom: 2.54,114.3 0,111.76 0,110.49 0,-1.27 2.54,-3.81 223.52,-3.81 229.87,2.54 229.87,110.49 226.06,114.3
GND2
  Bottom 0.813: SV13.7 SV12.34
GND3
  Bottom 0.813: SV13.5 SV12.30
GND4
  Bottom 0.813: SV15.10 SV12.20
GND5
  Bottom 0.813: SV15.7 SV12.14
GND6
  Bottom 0.813: SV12.6 SV15.3 SV15.4 68.58,107.44 SV12.8
GND7
  Bottom 0.813: SV12.9 SV16.6
GPIO0
  Top 0.813: SV12.27 SV14.7
GPIO1
  Bottom 0.813: SV13.4 SV12.28
GPIO4
  Bottom 0.813: SV12.7 SV16.7
GPIO5
  Top 0.813: SV12.29 SV14.6
GPIO6
  Top 0.813: SV12.31 SV14.5
GPIO7
  Bottom 0.813: SV13.3 SV12.26
GPIO8
  Bottom 0.813: SV13.2 SV12.24
GPIO9
  Top 0.813: SV12.21 SV14.10
GPIO10
  Top 0.813: SV12.19 SV16.1
GPIO11
  Top 0.813: SV12.23 SV14.9
GPIO12
  Bottom 0.813: SV13.6 SV12.32
GPIO13
  Top 0.813: SV12.33 SV14.4
GPIO16
  Bottom 0.813: SV13.8 SV12.36
GPIO17
  Bottom 0.813: SV12.11 SV16.5
GPIO19
  Top 0.813: SV12.35 SV14.3
GPIO20
  Bottom 0.813: SV13.9 SV12.38
GPIO21
  Bottom 0.813: SV13.10 SV12.40
GPIO22
  Bottom 0.813: SV12.15 SV16.3
GPIO23
  Bottom 0.813: SV15.8 SV12.16
GPIO24
  Bottom 0.813: SV15.9 SV12.18
GPIO25
  Bottom 0.813: SV13.1 SV12.22
GPIO26
  Top 0.813: SV12.37 SV14.2
GPIO27
  Bottom 0.813: SV12.13 SV16.4
N$9  (via drill 1)
  other vias: 28.7,47.75
N$10  (via drill 1)
  other vias: 27.18,70.87
N$17
  Top 0.813: LED1.K R1.1
N$21
  Top 0.813: LED2.K R2.1
N$33
  Bottom 0.813: R10.1 LED6.K
N$49
  Top 1.778: LED7.K R11.2
N$52
  Top 1.27: ULN2003.7 SV20.2
N$65
  Top 1.27: J1.2 ULN2003.16
  Top 2.54: ULN2003.16 ULN2003.15
N$67
  Top 1.27: ULN2003.13 21.59,97.79 | 21.59,97.79 ULN2003.14 | J2.2 12.7,97.79 21.59,97.79
N$69
  Top 1.27: J3.2 13.97,102.87 21.59,102.87 ULN2003.11 ULN2003.12
N$77
  Top 0.813: LED4.K R4.1
N$85
  Top 0.813: R5.1 LED5.K
N$143
  Bottom 0.813: SV15.5 SV12.10
RESET
  Top 0.813: SV19.1 PCB1.RESET
  Bottom 1.676: SV19.1 115.06,33.02 113.79,34.29 S1.1B S1.1A
RX
  Top 0.813: R9.1 75.57,105.41 73.66,107.31 SV15.6
  Bottom 0.813: SV15.6 SV12.12
SCL
  Bottom 0.813: SV12.5 SV16.8
SDA
  Bottom 0.813: SV12.3 SV16.9
VAR_V
  Top 1.778: LED1.A 51.43,80.01 U$1.OUT+ 65.26,83.33 73.66,74.93 VARREL.3 VARREL.2 VARREL.1
  Bottom 1.778: 223.52,13.46 220.73,16.26 217.93,16.26 213.36,20.83 SERVO1.2 SERVO2.2 | 109.98,3.05 110.24,3.05 109.73,3.56 102.87,3.56 91.44,14.99 91.44,52.58 83.82,60.2 78.23,60.2 VARREL.1
  Bottom 1.93: 110.24,3.05 219.71,3.05 223.52,6.86 223.52,13.46
VIN
  Top 3.556: JACK1.TIP 14.88,3.41 | 14.88,3.41 SCREW_TERMINAL2.1 | SCREW_TERMINAL2.1 17.78,8.93 17.78,16.51 11.43,22.86 D4.A | 14.88,3.41 15.5,2.79 34.29,2.79 | JACK2.TIP 53.34,4.58 53.34,2.79 34.29,2.79 | SCREW_TERMINAL1.1 34.33,2.83 34.29,2.79 | SCREW_TERMINAL2.1 19.05,7.58 19.05,3.81

### Text on the board
tPlace: (2,4,6,8,10,12,14,16,18,20,22,24,26,28,30,32,34,36,38,40) | 8 | 5K | 7 | 6 | GND | 50,51 | 48,49 | 46,47 | 5 | 52,53 | 44,45 | 42,43 | 40,41 | 38,39 | 36,37 | 34,35 | 32,33 | 30,31 | 28,29 | 26,27 | 24,25 | 22,23 | 5VC | 4 | 10K | IITR | 3 | 2 | A15 | 16,17,- | 1 | A14 | PI_COMM | A13 | (1,3,5,7,9,11,13,15,17,19,21,23,25,27,29,31,33,35,37,39) | A12 | 20,21,5V,- | ULTRA4 | A11 | IR3 | IR2 | A10 | 5V,-,A12 | 5V,A11,- | ENCODER3 | A9 | IR1 | A8 | 18,19,5V,- | 5V,A8,A9,- | 5V,-,A10 | VAR_V | A7 | ENCODER2 | 5V,A6,A7,- | A6 | 14 15 16 17 18 19 20 21 | 2,3,5V,- | 5VREL | ULTRA3 | A5 | VARREL | A4 | ULTRA2 | ENCODER1 | A3 | 5V,A4,A5,- | 5V,A2,A3,- | 14,5,15,4.- | A2 | A1 | A0 | CYTRON3 | 5V | ULTRA1 | GNDREL | 22,7,24,6,- | VIN | 7 6 5 4 3 2 1 0 | CYTRON1 | GND | 30,9,32,8,- | GND | 5V | 9VREL | 12VREL | 3.3V | CYTRON2 | 11,var,- | RESET | SERVO2 | - 13 12 11 10 9 8 | 12,var,- | AREF | RESET | SERVO1 | -,48,42,10 | -,40,38,11 | 7809 | NEX1 | NEX2